# Altium project PCB_BanXoay.PrjPcb
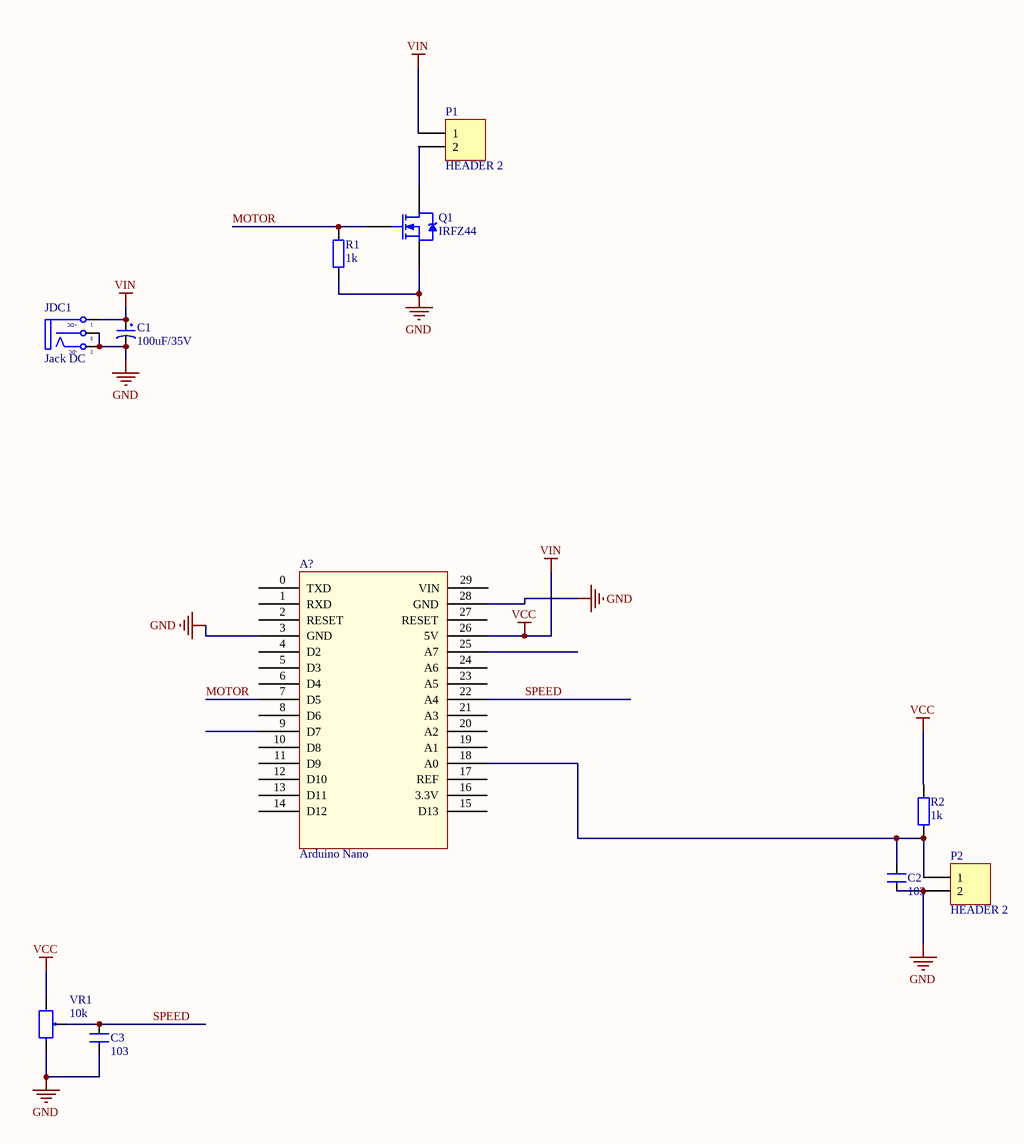
[diagram p0: BanXoay.SchDoc]
1 sheet, 11 parts. Net scope: global (net labels, ports and power ports of the same name join across sheets).
Board file: BanXoay.PcbDoc

## Sheet BanXoay.SchDoc
size A0

### Parts
A?  Arduino Nano  [Arduino Nano]
C1  100uF/35V  [CP1.5/3.4]
C2  103  [SM-0805]
C3  103  [SM-0805]
JDC1  Jack DC  [DC5]
P1  HEADER 2  [CON 2]
P2  HEADER 2  [CON 2]
Q1  IRFZ44  [TO252-123]
R1  1k  [RES-SMD-0805]
R2  1k  [RES-SMD-0805]
VR1  10k  [VR-S1]

### Nets
GND: A?.3(GND) A?.28(GND) C1.2 C2.1 C3.1 JDC1.2(TN) JDC1.3(S) P2.2 Q1.3(S) R1.1 VR1.3
VCC: A?.26(5V) C1.1 JDC1.1(T) P1.1 R2.2 VR1.1  [also labelled VIN]
MOTOR: A?.7(D5) Q1.1(G) R1.2
SPEED: A?.22(A4) C3.2 VR1.2
NetA?_18: A?.18(A0) C2.2 P2.1 R2.1
NetP1_2: P1.2 Q1.2(D)

Not connected (* = marked no-connect by the designer): A? 0(TXD) 1(RXD) 2(RESET) 4(D2) 5(D3) 6(D4) 8(D6) 9(D7) 10(D8) 11(D9) 12(D10) 13(D11) 14(D12) 15(D13) 16(3.3V) 17(REF) 19(A1) 20(A2) 21(A3) 23(A5) 24(A6) 25(A7) 27(RESET) 29(VIN)

### Notes on the sheet
- (in symbol JACK_DC) +DC; -DC

### Library data of the parts
C1 = CP3: Cap 100uF/35V - 470uF/16V; Value: 100uF/35V/50V; Description 1: 1000uF/6,3V - 470uF/16V - 330uF - 25V; Description 2: 220uF/35V - 100uF/50V - 63V - 4,7uF/200V; Description 3: 22uF => 33uF100V - 3,3uF => 4,7uF/250V; Description 4: 2,2uF =>3,3uF/350 - 2,2uF/400V - 1uF/450V
C2 C3 = CM: Cap SMD; Value: 103
JDC1 = JACK_DC
Q1 = IRFZ44: Value: IRF840
R1 R2 = R: Resistor R1/4W
VR1 = Resistor Var